# Altium project BMS_Slave.PrjPcb
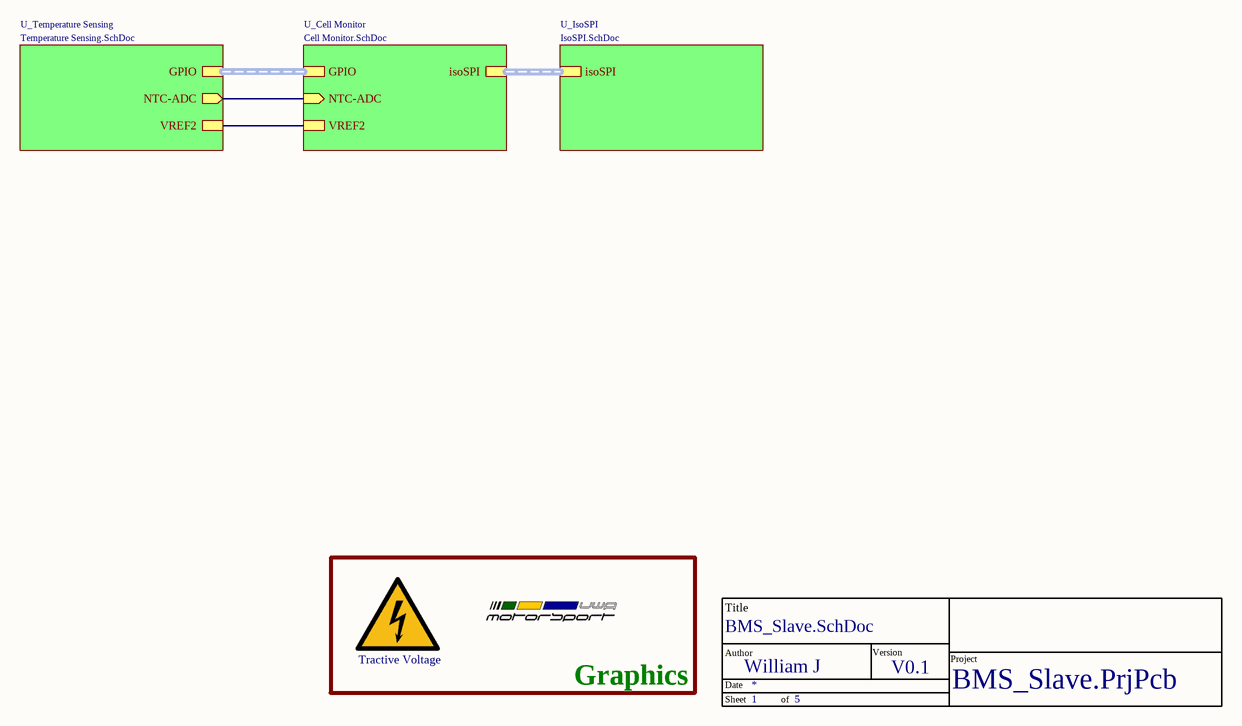
[diagram p0: BMS_Slave.SchDoc]
ProAuthor: William J; Version: V0.1
5 sheets, 168 parts. Net scope: hierarchical (ports join the sheet entries above them; power ports are global).
Sheets:
  BMS_Slave.SchDoc
    U_Cell Monitor = Cell Monitor.SchDoc
      Balance Circuit1 = Balance.SchDoc
      Balance Circuit2 = Balance.SchDoc
      Balance Circuit3 = Balance.SchDoc
      Balance Circuit4 = Balance.SchDoc
      Balance Circuit5 = Balance.SchDoc
      Balance Circuit6 = Balance.SchDoc
      Balance Circuit7 = Balance.SchDoc
      Balance Circuit8 = Balance.SchDoc
      Balance Circuit9 = Balance.SchDoc
      Balance Circuit10 = Balance.SchDoc
      Balance Circuit11 = Balance.SchDoc
      Balance Circuit12 = Balance.SchDoc
    U_IsoSPI = IsoSPI.SchDoc
    U_Temperature Sensing = Temperature Sensing.SchDoc

## Sheet BMS_Slave.SchDoc
size A4; SheetNumber: 1; SheetTotal: 5

### Parts
(Parts that share a designator on the sheet are numbered #1, #2 ... from top to bottom, then left to right.)
*#1  UWAM Logo  [UWAM Logo]  (value not drawn)  (graphical)
*#2  TitleBlock  (value not drawn)  (graphical)
aaa  Tractive voltage symbol  [Tractive voltage]  (value not drawn)  (no BOM)

### Blocks framed on the sheet
Graphics: *#1 aaa

### Sub-sheets
U_Cell Monitor = Cell Monitor.SchDoc: GPIO (harness GPIO), isoSPI (harness isoSPI), VREF2, NTC-ADC (in)
U_IsoSPI = IsoSPI.SchDoc: isoSPI (harness isoSPI)
U_Temperature Sensing = Temperature Sensing.SchDoc: GPIO (harness GPIO), NTC-ADC (out), VREF2

### Nets
VREF2: sheet U_Cell Monitor/VREF2, sheet U_Temperature Sensing/VREF2
NetU1_33: sheet U_Cell Monitor/NTC-ADC, sheet U_Temperature Sensing/NTC-ADC

### Buses and harness runs
harness sheet U_Cell Monitor/GPIO = sheet U_Temperature Sensing/GPIO
harness sheet U_Cell Monitor/isoSPI = sheet U_IsoSPI/isoSPI

### Notes on the sheet
- (in symbol TitleBlock) Title; Author; Version; Project; Date; Sheet; of
- (in symbol Tractive voltage symbol) Tractive Voltage

## Sheet Cell Monitor.SchDoc
size A4; SheetNumber: 2; SheetTotal: 6
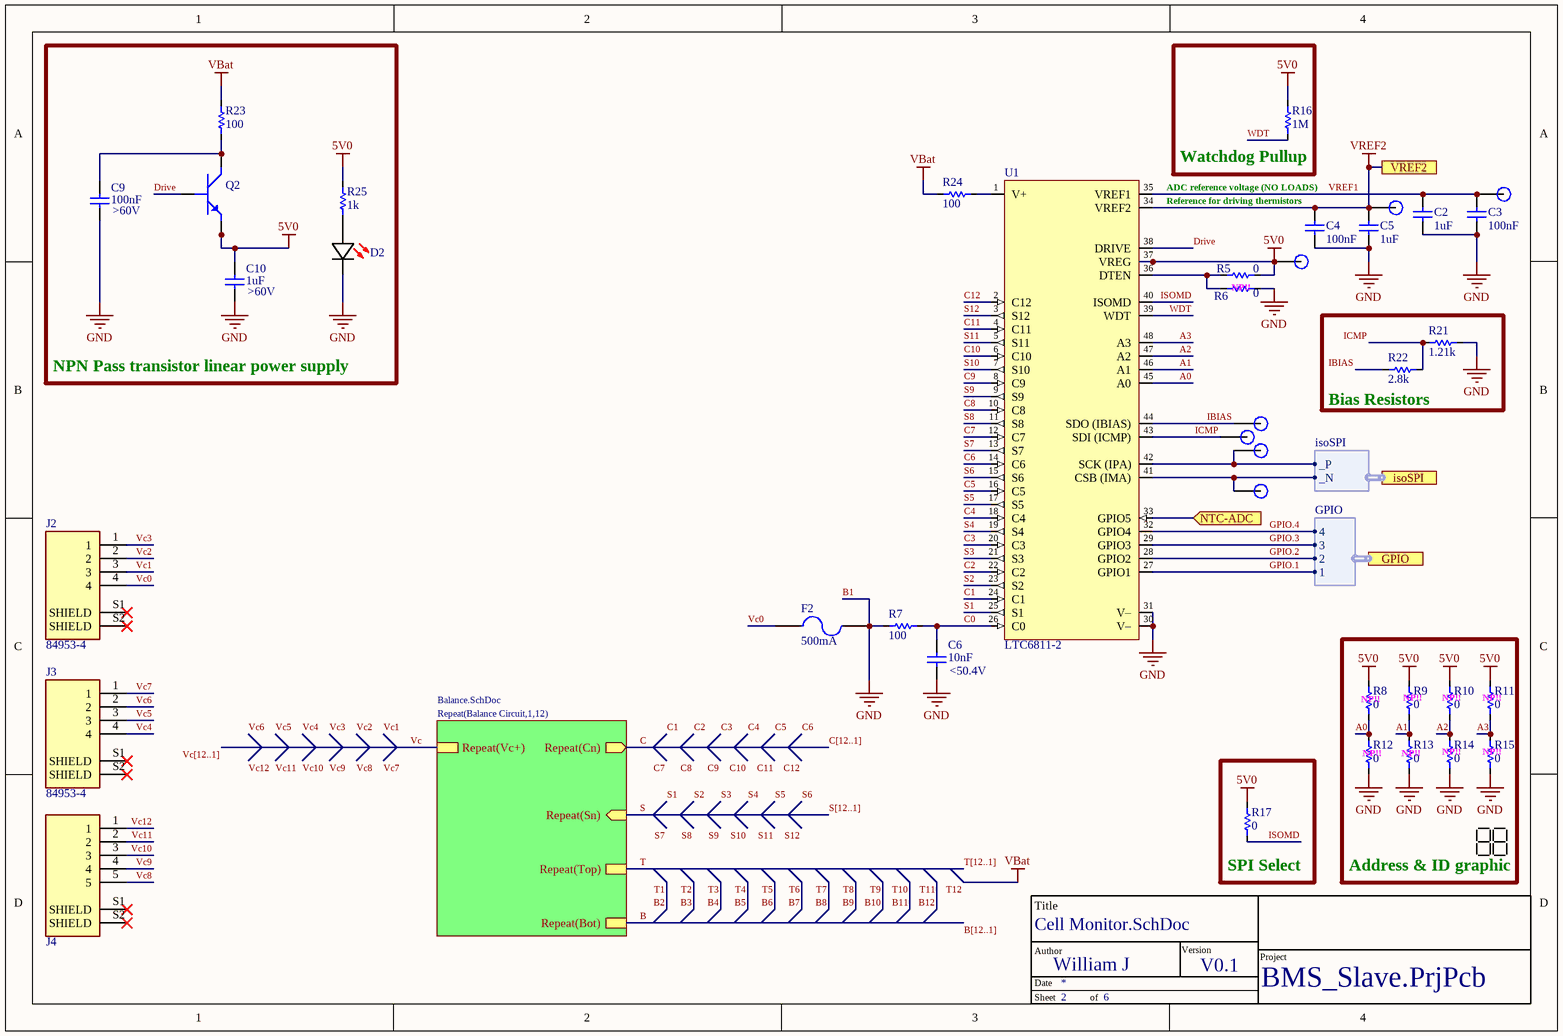
[diagram p1: Cell Monitor.SchDoc]

### Parts
(Parts that share a designator on the sheet are numbered #1, #2 ... from top to bottom, then left to right.)
*#3  TitleBlock  (value not drawn)  (graphical)
C2  value 1uF  [C-0402]  (hidden comment: C)
C3  value 100nF  [C-0402]  (hidden comment: C)
C4  value 100nF  [C-0402]  (hidden comment: C)
C5  value 1uF  [C-0402]  (hidden comment: C)
C6  value 10nF  Voltage: <50.4V  [C_0603]  (hidden comment: C)
C9  value 100nF  Voltage: >60V  [C_0603]  (hidden comment: C)
C10  value 1uF  Voltage: >60V  [C_0603]  (hidden comment: C)
D2  150060SS55040  [LED (0603)]  (value not drawn)
F2  Current Rating: 500mA  [0466.500NR]  (hidden comment: 0466.500NR)
J2  84953-4  [84953-4]
J3  84953-4  [84953-4]
J4  84953-5  [84953-5]  (value not drawn)
NT1  NetTie  [NetTie]  (value not drawn)  (net tie, no BOM)
NT2  NetTie  [NetTie]  (value not drawn)  (net tie, no BOM)
Q2  PHPT60603NYX  [LFPAK56 (SOT669)]  (value not drawn)
R5  value 0  [R_0402]  (hidden comment: Resistor)
R6  value 0  [R_0402]  (hidden comment: Resistor)
R7  value 100  [R-0603]  (hidden comment: Resistor)
R8  value 0  [R_0402]  (hidden comment: Resistor)
R9  value 0  [R_0402]  (hidden comment: Resistor)
R10  value 0  [R_0402]  (hidden comment: Resistor)
R11  value 0  [R_0402]  (hidden comment: Resistor)
R12  value 0  [R_0402]  (hidden comment: Resistor)
R13  value 0  [R_0402]  (hidden comment: Resistor)
R14  value 0  [R_0402]  (hidden comment: Resistor)
R15  value 0  [R_0402]  (hidden comment: Resistor)
R16  value 1M  [R_0402]  (hidden comment: Resistor)
R17  value 0  [R_0402]  (hidden comment: Resistor)
R21  value 1.21k  [R_0402]  (hidden comment: Resistor)
R22  value 2.8k  [R_0402]  (hidden comment: Resistor)
R23  value 100  [R_2010]  (hidden comment: Resistor)
R24  value 100  [R_2010]  (hidden comment: Resistor)
R25  value 1k  [R-0603]  (hidden comment: Resistor)
S1  2x7Segment  [2x7Segment]  (value not drawn)  (no BOM)
TP1  VREF1  [Test Point]  (value not drawn)  (no BOM)
TP2  VREF2  [Test Point]  (value not drawn)  (no BOM)
TP3  5V0  [Test Point]  (value not drawn)  (no BOM)
TP4  IBIAS  [Test Point]  (value not drawn)  (no BOM)
TP5  ICMP  [Test Point]  (value not drawn)  (no BOM)
TP6  IPA  [Test Point]  (value not drawn)  (no BOM)
TP7  IMA  [Test Point]  (value not drawn)  (no BOM)
U1  LTC6811-2  [SSOP50P780X200-48N]

### Blocks framed on the sheet
NPN Pass transistor linear power supply: C9 C10 D2 Q2 R23 R25
Watchdog Pullup: R16
Bias Resistors: R21 R22
Address & ID graphic: R8-R15 S1
SPI Select: R17

### Sub-sheets
Repeat(Balance Circuit,1,12) = Balance.SchDoc: Repeat(Bot), Repeat(Vc+), Repeat(Top), Repeat(Cn) (out), Repeat(Sn) (in)

### Ports
GPIO (harness GPIO), isoSPI (harness isoSPI), NTC-ADC (in), VREF2

### Harnesses
GPIO: 1, 2, 3, 4
isoSPI: _P, _N

### Nets
5V0: C10.2 Q2.1(Emitter) Q2.2(Emitter) Q2.3(Emitter) R5.2 R8.2 R9.2 R10.2 R11.2 R16.2 R17.2 R25.2 TP3.1 U1.37(VREG)
GND: C2.1 C3.1 C4.1 C5.1 C6.1 C9.1 C10.1 D2.1(K) F2.2 NT1.1 R6.1 R7.1 R12.1 R13.1 R14.1 R15.1 R21.2 U1.30(V–) U1.31(V–)
VBat: NT2.2 R23.2 R24.2
VREF2: C4.2 C5.2 TP2.1 U1.34(VREF2) ; port VREF2
A0: R8.1 R12.2 U1.45(A0)
A1: R9.1 R13.2 U1.46(A1)
A2: R10.1 R14.2 U1.47(A2)
A3: R11.1 R15.2 U1.48(A3)
B: sheet Repeat(Balance Circuit,1,12)/Repeat(Bot)
B1: NT1.2
C: sheet Repeat(Balance Circuit,1,12)/Repeat(Cn)
C0: C6.2 R7.2 U1.26(C0)
C1: U1.24(C1)
C2: U1.22(C2)
C3: U1.20(C3)
C4: U1.18(C4)
C5: U1.16(C5)
C6: U1.14(C6)
C7: U1.12(C7)
C8: U1.10(C8)
C9: U1.8(C9)
C10: U1.6(C10)
C11: U1.4(C11)
C12: U1.2(C12)
Drive: Q2.4(Base) U1.38(DRIVE)
GPIO.1: U1.27(GPIO1) ; port GPIO.1
GPIO.2: U1.28(GPIO2) ; port GPIO.2
GPIO.3: U1.29(GPIO3) ; port GPIO.3
GPIO.4: U1.32(GPIO4) ; port GPIO.4
IBIAS: R22.1 TP4.1 U1.44(SDO_(IBIAS))
ICMP: R21.1 R22.2 TP5.1 U1.43(SDI_(ICMP))
ISOMD: R17.1 U1.40(ISOMD)
isoSPI._N: TP7.1 U1.41(CSB_(IMA)) ; port isoSPI._N
isoSPI._P: TP6.1 U1.42(SCK_(IPA)) ; port isoSPI._P
S: sheet Repeat(Balance Circuit,1,12)/Repeat(Sn)
S1: U1.25(S1)
S2: U1.23(S2)
S3: U1.21(S3)
S4: U1.19(S4)
S5: U1.17(S5)
S6: U1.15(S6)
S7: U1.13(S7)
S8: U1.11(S8)
S9: U1.9(S9)
S10: U1.7(S10)
S11: U1.5(S11)
S12: U1.3(S12)
T: sheet Repeat(Balance Circuit,1,12)/Repeat(Top)
T12: NT2.1
Vc: sheet Repeat(Balance Circuit,1,12)/Repeat(Vc+)
Vc0: F2.1 J2.4
Vc1: J2.3
Vc2: J2.2
Vc3: J2.1
Vc4: J3.4
Vc5: J3.3
Vc6: J3.2
Vc7: J3.1
Vc8: J4.5
Vc9: J4.4
Vc10: J4.3
Vc11: J4.2
Vc12: J4.1
VREF1: C2.2 C3.2 TP1.1 U1.35(VREF1)
WDT: R16.1 U1.39(WDT)
NetC9_2: C9.2 Q2.5(Collector) R23.1
NetD2_2: D2.2(A) R25.1
NetR5_1: R5.1 R6.2 U1.36(DTEN)
NetR24_1: R24.1 U1.1(V+)
NetU1_33: U1.33(GPIO5) ; port NTC-ADC

Not connected (* = marked no-connect by the designer): J2 S1(SHIELD)* S2(SHIELD)*; J3 S1(SHIELD)* S2(SHIELD)*; J4 S1(SHIELD)* S2(SHIELD)*

### Buses and harness runs
bus B[12..1]
bus C[12..1]
bus S[12..1]
bus T[12..1]
bus Vc[12..1]

### Notes on the sheet
- ADC reference voltage (NO LOADS)
- (near C4) Reference for driving thermistors
- (near R6) NP!!
- (near R8) NP!!
- (near R9) NP!!
- (near R10) NP!!
- (near R11) NP!!
- (near R12) NP!!
- (near R13) NP!!
- (near R14) NP!!
- (near R15) NP!!
- Labels drawn without touching a wire or pin: C1, C2, C3, C4, C5, C6, C7, C8, C9, C10, C11, C12, S1, S2, S3, S4, S5, S6, S7, S8, S9, S10, S11, S12, Vc1, Vc2, Vc3, Vc4, Vc5, Vc6, Vc7, Vc8, Vc9, Vc10, Vc11, Vc12
- (in symbol TitleBlock) Title; Author; Version; Project; Date; Sheet; of

### Library data of the parts
C2-C6 C9 C10 = Capacitor: ComponentLink1Description: New link; ComponentLink1URL: *
D2 = 150060SS55040: LED RED DIFFUSED 0603 SMD; Manufacturer: Wurth Electronics; Lens Style: Flat; Luminous Intensity: 70mcd; Forward Voltage: 2V; Test Current: 20mA; Viewing Angle: 140°; Dominant Wavelength: 630nm; Lens Size: 0.8mm; Supplier 1: Mouser; Manufacturer Part Number: 150060SS55040; RoHS: No; Category: LEDs; Stock 1: 17006; Pricing 1: 1=0.18000, 10=0.16800, 50=0.16800, 100=0.15200, 1000=0.12100, 10000=0.10600 (USD); Mount: Surface Mount; Case/Package: 0603; Color: Red; Case Code (Imperial): 0603; Case Code (Metric): 1608; Packaging: Tape and Reel; Lens Transparency: Diffused; Length: 1.6mm; Width: 0.8mm; Height: 0.5mm; RoHS Compliant: No; Supplier Part Number 1: 710-150060SS55040
F2 = Fuse 2: LITTELFUSE - 0466.500NR - Fuse, Surface Mount, 500 mA, 466 Series, 63 VAC, 63 VDC, Very Fast Acting, 1206; Body Material: Thermoplastic; Voltage Rating (AC): 63V; Resistance: 350mR; DC Cold Resistance: 248mR; Fuse Type: Board Mount (Cartridge Style Excluded); Approvals: UL,CSA; Published: 8-Jun-2000; LatestRevisionDate: 17-Jul-2002; LatestRevisionNote: Re-released for DXP Platform.; PackageReference: PIN-W2/E2.8; Publisher: Altium Limited; PackageDescription: Thru-Hole; 2 Leads; Supplier 1: Mouser; Supplier Part Number 1: 576-0466.500NR; Manufacturer: Littelfuse; Manufacturer Part Number: 0466.500NR; RoHS: Yes; Category: Fuses; Stock 1: 36497; Pricing 1: 1=0.77000, 10=0.59200, 50=0.59200, 100=0.48900, 1000=0.41600, 10000=0.39000 (USD); Mount: Surface Mount; Case/Package: 1206; Number of Pins: 2; Case Code (Metric): 3216; Case Code (Imperial): 1206; Housing Material: Ceramic; Terminal Material: Copper; Min Operating Temperature: -55°C; Max Operating Temperature: 90°C; Packaging: Tape and Reel; Package Quantity: 5000; Voltage Rating (DC): 63V; Series: 466; Voltage Rating: 63V; Termination: SMD/SMT; Fuse Current: 500mA; Working Voltage: 63V; Length: 3.18mm; Width: 0.06inch; Height: 0.023inch; Depth: 1.52mm; Radiation Hardening: No; RoHS Compliant: Yes; REACH SVHC: Unknown; Lead Free: Lead Free; ComponentLink1URL: https://datasheet.ciiva.com/17081/0466-500nr-17081083.pdf?src-supplier=Allied+Electronics; ComponentLink1Description: https://datasheet.ciiva.com/17081/0466-500nr-17081083.pdf?src-supplier=Allied+Electronics; ComponentLink2URL: https://datasheet.ciiva.com/16327/littelfuse-fuse-466-16327478.pdf?src-supplier=Future+Electronics; ComponentLink2Description: https://datasheet.ciiva.com/16327/littelfuse-fuse-466-16327478.pdf?src-supplier=Future+Electronics; ComponentLink3URL: https://datasheet.ciiva.com/299/466seriesdrawing-299207.pdf?src-supplier=Digi-Key; ComponentLink3Description: https://datasheet.ciiva.com/299/466seriesdrawing-299207.pdf?src-supplier=Digi-Key; ComponentLink4URL: https://datasheet.ciiva.com/299/466seriesdrawing-299208.pdf?src-supplier=Digi-Key; ComponentLink4Description: https://datasheet.ciiva.com/299/466seriesdrawing-299208.pdf?src-supplier=Digi-Key; ComponentLink5URL: https://datasheet.ciiva.com/299/466seriesdrawing-299209.pdf?src-supplier=Digi-Key; ComponentLink5Description: https://datasheet.ciiva.com/299/466seriesdrawing-299209.pdf?src-supplier=Digi-Key; ComponentLink6URL: https://datasheet.ciiva.com/14102/ei466-dat-e-14102891.pdf?src-supplier=Distrelec; ComponentLink6Description: https://datasheet.ciiva.com/14102/ei466-dat-e-14102891.pdf?src-supplier=Distrelec; ComponentLink7URL: https://datasheet.ciiva.com/15186/getdatasheetpartid-57351-15186924.pdf?src-supplier=Verical; ComponentLink7Description: https://datasheet.ciiva.com/15186/getdatasheetpartid-57351-15186924.pdf?src-supplier=Verical
J2 J3 = 84953-4: FPC Connectors, Flex-to-Board, 4 Position, .039 in [1 mm] Centerline, Zero Insertion Force (ZIF), Right Angle, Surface Mount; MF: {'manufacturer': u'TE Connectivity'}; Value: *; Availability: Unavailable; Package: None; MP: 84953-4; Price: None
J4 = 84953-5: FPC Connectors, Flex-to-Board, 5 Position, .039 in [1 mm] Centerline, Zero Insertion Force (ZIF), Right Angle, Surface Mount.
Q2 = PHPT60603NYX: 60V, 3 A NPN high power bipolar transistor
TP1-TP7 = Test Point: 1.2mm Test point
U1 = LTC6811-2: 12 Channel Multicell Battery Monitor with Addressable Interface

## Sheet Balance.SchDoc
size A4; SheetNumber: 3; SheetTotal: 6
Used 12 times, as channels U_Cell Monitor/Balance Circuit1, U_Cell Monitor/Balance Circuit2, U_Cell Monitor/Balance Circuit3, U_Cell Monitor/Balance Circuit4, U_Cell Monitor/Balance Circuit5, U_Cell Monitor/Balance Circuit6, U_Cell Monitor/Balance Circuit7, U_Cell Monitor/Balance Circuit8, U_Cell Monitor/Balance Circuit9, U_Cell Monitor/Balance Circuit10, U_Cell Monitor/Balance Circuit11, U_Cell Monitor/Balance Circuit12. Parts and nets are listed once, with the designators drawn on the sheet.
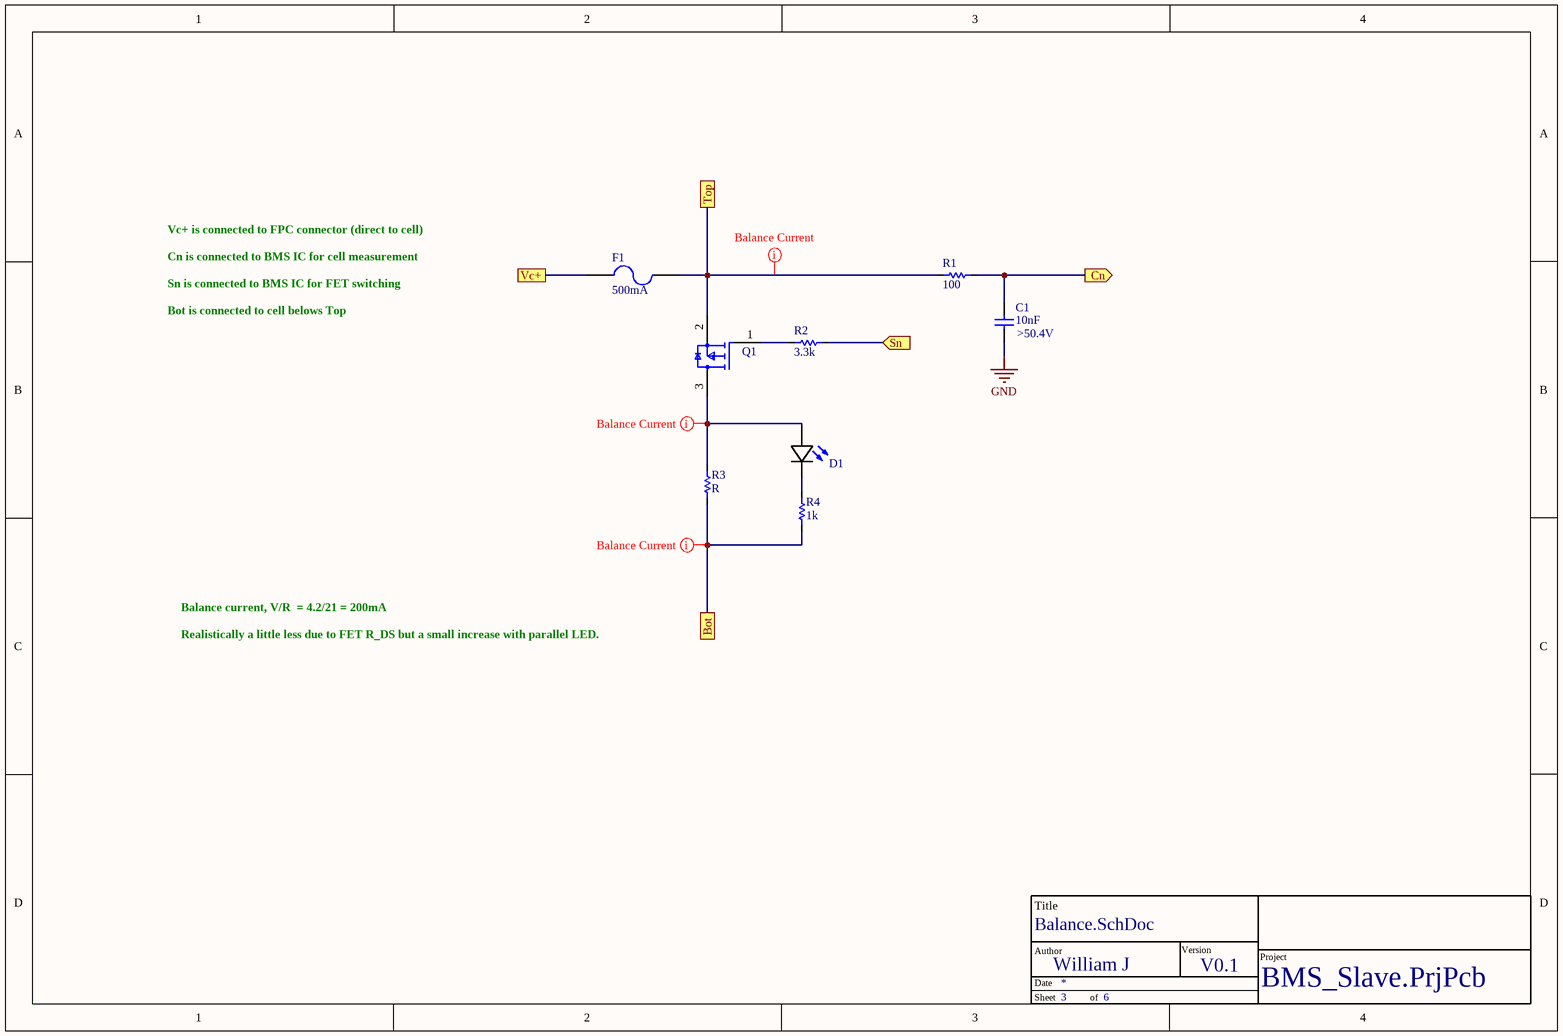
[diagram p2: Balance.SchDoc]

### Parts
*  TitleBlock  (value not drawn)  (graphical)
C1  value 10nF  Voltage: >50.4V  [C_0603]  (hidden comment: C)
D1  150060BS55040  [LED (0603)]  (value not drawn)
F1  Current Rating: 500mA  [0466.500NR]  (hidden comment: 0466.500NR)
Q1  NX2301P,215  [FP-SOT23-MFG]  (value not drawn)
R1  value 100  [R-0603]  (hidden comment: Resistor)
R2  value 3.3k  [R-0603]  (hidden comment: Resistor)
R3  value R  [R_2512]  (hidden comment: Resistor)
R4  value 1k  [R-0603]  (hidden comment: Resistor)

### Ports
Bot, Cn (out), Sn (in), Top, Vc+

### Nets
GND: C1.1
Bot: R3.1 R4.1 ; port Bot
Cn: C1.2 R1.2 ; port Cn
Sn: R2.2 ; port Sn
Top: F1.2 Q1.2(S) R1.1 ; port Top
Vc+: F1.1 ; port Vc+
NetD1_1: D1.1(K) R4.2
NetD1_2: D1.2(A) Q1.3(D) R3.2
NetQ1_1: Q1.1(G) R2.1

### Channels
U_Cell Monitor/Balance Circuit1: designators end in _Balance_Circuit1; ports Bot=B1 Cn=C1 Sn=S1 Top=B2 Vc+=Vc1
U_Cell Monitor/Balance Circuit2: designators end in _Balance_Circuit2; ports Bot=B2 Cn=C2 Sn=S2 Top=B3 Vc+=Vc2
U_Cell Monitor/Balance Circuit3: designators end in _Balance_Circuit3; ports Bot=B3 Cn=C3 Sn=S3 Top=B4 Vc+=Vc3
U_Cell Monitor/Balance Circuit4: designators end in _Balance_Circuit4; ports Bot=B4 Cn=C4 Sn=S4 Top=B5 Vc+=Vc4
U_Cell Monitor/Balance Circuit5: designators end in _Balance_Circuit5; ports Bot=B5 Cn=C5 Sn=S5 Top=B6 Vc+=Vc5
U_Cell Monitor/Balance Circuit6: designators end in _Balance_Circuit6; ports Bot=B6 Cn=C6 Sn=S6 Top=B7 Vc+=Vc6
U_Cell Monitor/Balance Circuit7: designators end in _Balance_Circuit7; ports Bot=B7 Cn=C7 Sn=S7 Top=B8 Vc+=Vc7
U_Cell Monitor/Balance Circuit8: designators end in _Balance_Circuit8; ports Bot=B8 Cn=C8 Sn=S8 Top=B9 Vc+=Vc8
U_Cell Monitor/Balance Circuit9: designators end in _Balance_Circuit9; ports Bot=B9 Cn=C9 Sn=S9 Top=B10 Vc+=Vc9
U_Cell Monitor/Balance Circuit10: designators end in _Balance_Circuit10; ports Bot=B10 Cn=C10 Sn=S10 Top=B11 Vc+=Vc10
U_Cell Monitor/Balance Circuit11: designators end in _Balance_Circuit11; ports Bot=B11 Cn=C11 Sn=S11 Top=B12 Vc+=Vc11
U_Cell Monitor/Balance Circuit12: designators end in _Balance_Circuit12; ports Bot=B12 Cn=C12 Sn=S12 Top=T12 Vc+=Vc12

### Layout directives
net class BalanceNetClass: B1, B2, NetD1_Balance_Circuit1_2

### Notes on the sheet
- Vc+ is connected to FPC connector (direct to cell)
  Cn is connected to BMS IC for cell measurement
  Sn is connected to BMS IC for FET switching
  Bot is connected to cell belows Top
- Balance current, V/R  = 4.2/21 = 200mA
  Realistically a little less due to FET R_DS but a small increase with parallel LED.
- (in symbol TitleBlock) Title; Author; Version; Project; Date; Sheet; of

### Library data of the parts
C1 = Capacitor: ComponentLink1Description: New link; ComponentLink1URL: *
D1 = 150060BS55040: LED BLUE DIFFUSED 0603 SMD; Manufacturer: Wurth Electronics; Lens Style: Flat; Luminous Intensity: 80mcd; Forward Voltage: 3.2V; Test Current: 20mA; Viewing Angle: 140°; Dominant Wavelength: 470nm; Lens Size: 0.8mm; Supplier 1: Mouser; Manufacturer Part Number: 150060BS55040; RoHS: No; Pricing 1: 1=0.18000, 10=0.16800, 50=0.16800, 100=0.15200, 1000=0.12100, 10000=0.10600 (USD); Mount: Surface Mount; Case/Package: 0603; Color: Blue; Packaging: Tape and Reel; Lens Transparency: Diffused; Length: 1.6mm; Width: 0.8mm; Height: 0.5mm; RoHS Compliant: No; ComponentLink1URL: http://www.farnell.com/datasheets/2621640.pdf?src-supplier=Farnell; ComponentLink1Description: http://www.farnell.com/datasheets/2621640.pdf?src-supplier=Farnell; ComponentLink2URL: https://www.we-online.de/web/en/index.php/download/media/07_electronic_components/download_center_1/application_notes_berichte/ano002_leds___the_future_of_horticultural_lighting/ANO002b_EN_LEDs_The_Future_of_Horticultural_Lighting.pdf?src-supplier=Digi-Key; ComponentLink2Description: https://www.we-online.de/web/en/index.php/download/media/07_electronic_components/download_center_1/application_notes_berichte/ano002_leds___the_future_of_horticultural_lighting/ANO002b_EN_LEDs_The_Future_of_Horticultural_Lighting.pdf?src-supplier=Digi-Key; ComponentLink3URL: https://katalog.we-online.de/pbs/datasheet/150060BS55040.pdf?src-supplier=Digi-Key; ComponentLink3Description: https://katalog.we-online.de/pbs/datasheet/150060BS55040.pdf?src-supplier=Digi-Key; ComponentLink4URL: http://www.farnell.com/datasheets/2621640.pdf?src-supplier=Newark; ComponentLink4Description: http://www.farnell.com/datasheets/2621640.pdf?src-supplier=Newark; Supplier Part Number 1: 710-150060BS55040
F1 = Fuse 2: as F2 on sheet Cell Monitor; Published: 8-Jun-2000; LatestRevisionDate: 17-Jul-2002; LatestRevisionNote: Re-released for DXP Platform.; PackageReference: PIN-W2/E2.8; Publisher: Altium Limited; PackageDescription: Thru-Hole; 2 Leads; Supplier 1: Mouser; Supplier Part Number 1: 576-0466.500NR; Manufacturer: Littelfuse; Manufacturer Part Number: 0466.500NR; RoHS: Yes; Category: Fuses; Stock 1: 36497; Pricing 1: 1=0.77000, 10=0.59200, 50=0.59200, 100=0.48900, 1000=0.41600, 10000=0.39000 (USD); Mount: Surface Mount; Case/Package: 1206; Number of Pins: 2; Case Code (Metric): 3216; Case Code (Imperial): 1206; Housing Material: Ceramic; Terminal Material: Copper; Min Operating Temperature: -55°C; Max Operating Temperature: 90°C; Packaging: Tape and Reel; Package Quantity: 5000; Voltage Rating (DC): 63V; Series: 466; Voltage Rating: 63V; Termination: SMD/SMT; Fuse Current: 500mA; Working Voltage: 63V; Length: 3.18mm; Width: 0.06inch; Height: 0.023inch; Depth: 1.52mm; Radiation Hardening: No; RoHS Compliant: Yes; REACH SVHC: Unknown; Lead Free: Lead Free; ComponentLink1URL: https://datasheet.ciiva.com/17081/0466-500nr-17081083.pdf?src-supplier=Allied+Electronics; ComponentLink1Description: https://datasheet.ciiva.com/17081/0466-500nr-17081083.pdf?src-supplier=Allied+Electronics; ComponentLink2URL: https://datasheet.ciiva.com/16327/littelfuse-fuse-466-16327478.pdf?src-supplier=Future+Electronics; ComponentLink2Description: https://datasheet.ciiva.com/16327/littelfuse-fuse-466-16327478.pdf?src-supplier=Future+Electronics; ComponentLink3URL: https://datasheet.ciiva.com/299/466seriesdrawing-299207.pdf?src-supplier=Digi-Key; ComponentLink3Description: https://datasheet.ciiva.com/299/466seriesdrawing-299207.pdf?src-supplier=Digi-Key; ComponentLink4URL: https://datasheet.ciiva.com/299/466seriesdrawing-299208.pdf?src-supplier=Digi-Key; ComponentLink4Description: https://datasheet.ciiva.com/299/466seriesdrawing-299208.pdf?src-supplier=Digi-Key; ComponentLink5URL: https://datasheet.ciiva.com/299/466seriesdrawing-299209.pdf?src-supplier=Digi-Key; ComponentLink5Description: https://datasheet.ciiva.com/299/466seriesdrawing-299209.pdf?src-supplier=Digi-Key; ComponentLink6URL: https://datasheet.ciiva.com/14102/ei466-dat-e-14102891.pdf?src-supplier=Distrelec; ComponentLink6Description: https://datasheet.ciiva.com/14102/ei466-dat-e-14102891.pdf?src-supplier=Distrelec; ComponentLink7URL: https://datasheet.ciiva.com/15186/getdatasheetpartid-57351-15186924.pdf?src-supplier=Verical; ComponentLink7Description: https://datasheet.ciiva.com/15186/getdatasheetpartid-57351-15186924.pdf?src-supplier=Verical
Q1 = CMP-14409-000018-1: MOSFET P-CH 20V 2A TO-236AB

## Sheet IsoSPI.SchDoc
size A4; SheetNumber: 4; SheetTotal: 6
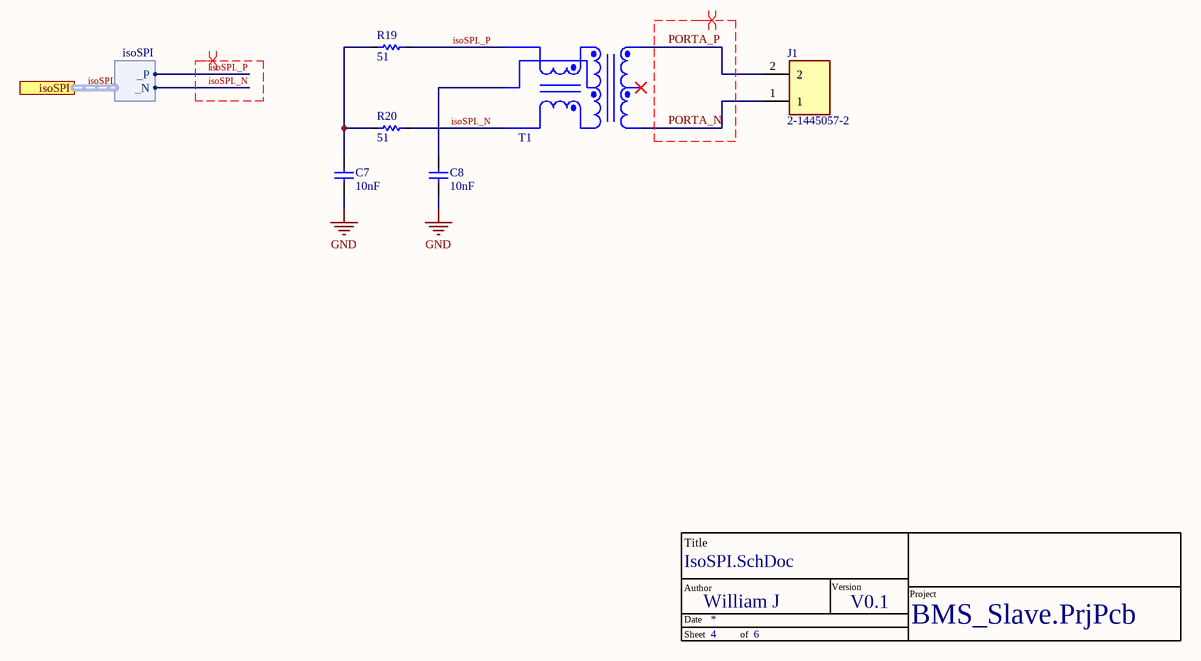
[diagram p3: IsoSPI.SchDoc]

### Parts
(Parts that share a designator on the sheet are numbered #1, #2 ... from top to bottom, then left to right.)
*#4  TitleBlock  (value not drawn)  (graphical)
C7  value 10nF  [C-0402]  (hidden comment: C)
C8  value 10nF  [C-0402]  (hidden comment: C)
J1  2-1445057-2  [TE_2-1445057-2]
R19  value 51  [R_0402]  (hidden comment: Resistor)
R20  value 51  [R_0402]  (hidden comment: Resistor)
T1  SM91502ALE  [SM91502ALE]  (value not drawn)

### Ports
isoSPI (harness isoSPI)

### Harnesses
isoSPI: _P, _N

### Nets
GND: C7.1 C8.1
isoSPI._N: R20.2 T1.4 ; port isoSPI._N
isoSPI._P: R19.2 T1.6 ; port isoSPI._P
PORTA_N: J1.1 T1.3
PORTA_P: J1.2 T1.1
NetC7_2: C7.2 R19.1 R20.1
NetC8_2: C8.2 T1.5

Not connected (* = marked no-connect by the designer): T1 2*

### Buses and harness runs
harness isoSPI = port isoSPI

### Layout directives
differential pair; differential pair class isoSPI: isoSPI._N, isoSPI._P, PORTA_N, PORTA_P

### Notes on the sheet
- (in symbol TitleBlock) Title; Author; Version; Project; Date; Sheet; of

### Library data of the parts
C7 C8 = Capacitor: ComponentLink1Description: New link; ComponentLink1URL: *
J1 = 2-1445057-2: CONN HEADER 3MM 2POS R/A TIN SMD; MF: {'manufacturer': u'TE Connectivity'}; Package: None; MP: 2-1445057-2; Availability: Unavailable; Price: None; Value: *
T1 = SM91502ALE: BMS XFORMER 1-CH 1000V AECQ +125; Manufacturer: Bourns; Inductance: 150uH; Turns Ratio: 1:1; Supplier 1: RSComponents; Manufacturer Part Number: SM91502ALE; RoHS: Yes; Category: Transformers; Stock 1: 1; Pricing 1: 800=2.35100 (USD); Mount: Surface Mount; Min Operating Temperature: -40°C; Max Operating Temperature: 125°C; Packaging: Cut Tape; ComponentLink1URL: https://www.bourns.com/docs/Product-Datasheets/SM91502AL.pdf?src-supplier=Digi-Key; ComponentLink1Description: https://www.bourns.com/docs/Product-Datasheets/SM91502AL.pdf?src-supplier=Digi-Key; Supplier Part Number 1: 1802382

## Sheet Temperature Sensing.SchDoc
size A4; SheetNumber: 5; SheetTotal: 6
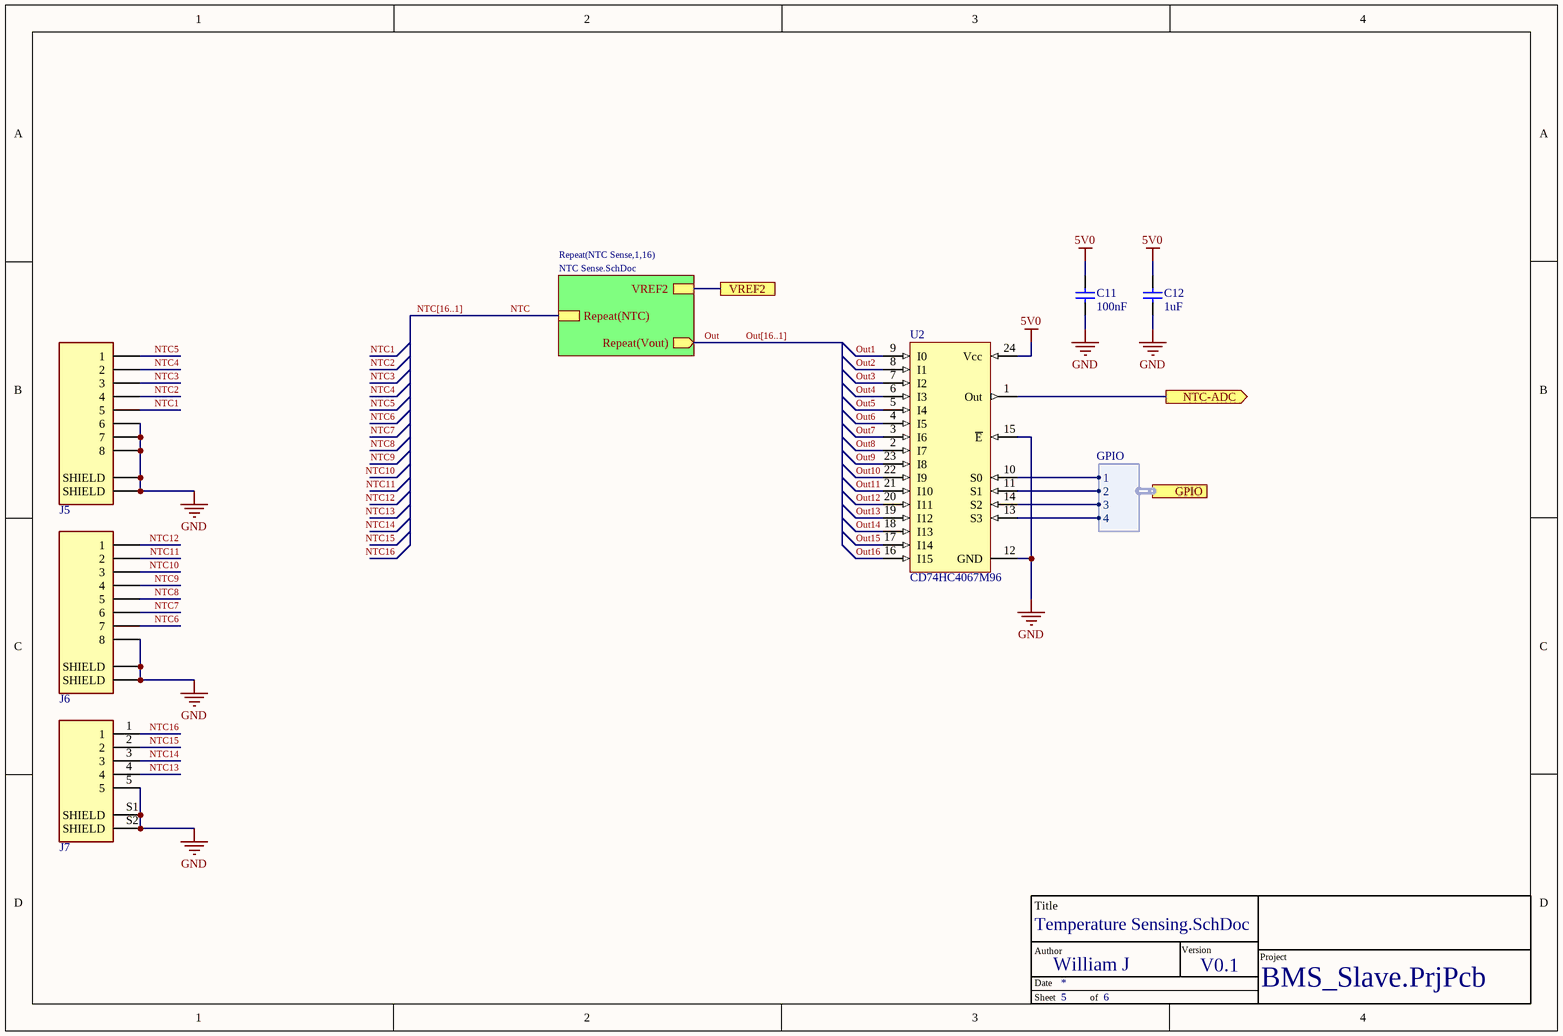
[diagram p4: Temperature Sensing.SchDoc]

### Parts
*?  TitleBlock  (value not drawn)  (graphical)
C11  value 100nF  [C_0603]  (hidden comment: C)
C12  value 1uF  [C_0603]  (hidden comment: C)
J5  84953-8  [84953-8]  (value not drawn)
J6  84953-8  [84953-8]  (value not drawn)
J7  84953-5  [84953-5]  (value not drawn)
U2  CD74HC4067M96  [SOIC127P1030X265-24N]

### Sub-sheets
Repeat(NTC Sense,1,16) = NTC Sense.SchDoc (file not in this document): VREF2, Repeat(Vout) (out), Repeat(NTC)

### Ports
GPIO (harness GPIO), NTC-ADC (out), VREF2

### Harnesses
GPIO: 4, 3, 2, 1

### Nets
5V0: C11.1 C12.2 U2.24(Vcc)
GND: C11.2 C12.1 J5.6 J5.7 J5.8 J5.S1(SHIELD) J5.S2(SHIELD) J6.8 J6.S1(SHIELD) J6.S2(SHIELD) J7.5 J7.S1(SHIELD) J7.S2(SHIELD) U2.12(GND) U2.15(~{E})
VREF2: port VREF2, sheet Repeat(NTC Sense,1,16)/VREF2
GPIO.1: U2.10(S0) ; port GPIO.1
GPIO.2: U2.11(S1) ; port GPIO.2
GPIO.3: U2.14(S2) ; port GPIO.3
GPIO.4: U2.13(S3) ; port GPIO.4
NTC: sheet Repeat(NTC Sense,1,16)/Repeat(NTC)
NTC1: J5.5
NTC2: J5.4
NTC3: J5.3
NTC4: J5.2
NTC5: J5.1
NTC6: J6.7
NTC7: J6.6
NTC8: J6.5
NTC9: J6.4
NTC10: J6.3
NTC11: J6.2
NTC12: J6.1
NTC13: J7.4
NTC14: J7.3
NTC15: J7.2
NTC16: J7.1
Out: sheet Repeat(NTC Sense,1,16)/Repeat(Vout)
Out1: U2.9(I0)
Out2: U2.8(I1)
Out3: U2.7(I2)
Out4: U2.6(I3)
Out5: U2.5(I4)
Out6: U2.4(I5)
Out7: U2.3(I6)
Out8: U2.2(I7)
Out9: U2.23(I8)
Out10: U2.22(I9)
Out11: U2.21(I10)
Out12: U2.20(I11)
Out13: U2.19(I12)
Out14: U2.18(I13)
Out15: U2.17(I14)
Out16: U2.16(I15)
NetU1_33: U2.1(Out) ; port NTC-ADC

### Buses and harness runs
bus NTC[16..1]
bus Out[16..1]

### Notes on the sheet
- (in symbol TitleBlock) Title; Author; Version; Project; Date; Sheet; of

### Library data of the parts
C11 C12 = Capacitor: ComponentLink1Description: New link; ComponentLink1URL: *
J5 J6 = 84953-8: FPC Connectors, Flex-to-Board, 8 Position, .039 in [1 mm] Centerline, Zero Insertion Force (ZIF), Right Angle, Surface Mount; Manufacturer: TE Connectivity; Body Plating: Tin; Voltage Rating: 200V; Number of Contacts: 8; Current Rating: 1A; Gender: Female; Connector Type: Receptacle,Connector,Socket; Shielding: Unshielded; Wire/Cable Type: Flat Flex; Mating Alignment: Yes (With); PCB Mount Alignment: No (Without); PCB Mount Retention: With; Contact Location: Top; Pitch: 0.039inch; Plating Thickness: 2um; Supplier 1: RSComponents; Manufacturer Part Number: 84953-8; RoHS: Yes; Category: FFC / FPC; Stock 1: 1; Pricing 1: 10=0.83500, 200=0.65000, 750=0.58600, 3000=0.55400, 6000=0.54000 (USD); Mount: Surface Mount; Contact Material: Bronze; Contact Plating: Tin,Bright; Housing Material: Polymer; Housing Color: Natural; Color: Natural; Material: Thermoplastic; Min Operating Temperature: -40°C; Max Operating Temperature: 85°C; Termination: SMD/SMT; Package Quantity: 1500; Packaging: Tape and Reel; Number of Rows: 1; Orientation: Right Angle; Contact Current Rating: 1A; Connector System: Flex-to-Board; Number of Positions: 8; PCB Mounting Orientation: Right Angle; Sealable: No (Without); Shrouded: Yes (With); Length: 0.6268inch; Width: 0.2575inch; Height: 2.56mm; Depth: 2.56mm; Lead Pitch: 1mm; Radiation Hardening: No; REACH SVHC: No SVHC; Flammability Rating: UL94 V-0; ComponentLink1URL: https://datasheet.ciiva.com/11745/0900766b806b36e9-11745458.pdf?src-supplier=RSComponents; ComponentLink1Description: https://datasheet.ciiva.com/11745/0900766b806b36e9-11745458.pdf?src-supplier=RSComponents; ComponentLink2URL: https://datasheet.ciiva.com/669/eng-cd-84953-a3-669123.pdf?src-supplier=Digi-Key; ComponentLink2Description: https://datasheet.ciiva.com/669/eng-cd-84953-a3-669123.pdf?src-supplier=Digi-Key; ComponentLink3URL: https://datasheet.ciiva.com/669/eng-cd-84953-a3-669124.pdf?src-supplier=Digi-Key; ComponentLink3Description: https://datasheet.ciiva.com/669/eng-cd-84953-a3-669124.pdf?src-supplier=Digi-Key; ComponentLink4URL: https://datasheet.ciiva.com/14483/eng-ds-1-1773440-6-0506-14483319.pdf?src-supplier=Farnell; ComponentLink4Description: https://datasheet.ciiva.com/14483/eng-ds-1-1773440-6-0506-14483319.pdf?src-supplier=Farnell; ComponentLink5URL: https://datasheet.ciiva.com/26825/getdatasheetpartid-473787-26825575.pdf?src-supplier=Verical; ComponentLink5Description: https://datasheet.ciiva.com/26825/getdatasheetpartid-473787-26825575.pdf?src-supplier=Verical; ComponentLink6URL: https://datasheet.ciiva.com/8066/586796-8066664.pdf?src-supplier=Element14; ComponentLink6Description: https://datasheet.ciiva.com/8066/586796-8066664.pdf?src-supplier=Element14; ComponentLink7URL: https://datasheet.ciiva.com/669/eng-cd-84953-a3-669122.pdf?src-supplier=Digi-Key; ComponentLink7Description: https://datasheet.ciiva.com/669/eng-cd-84953-a3-669122.pdf?src-supplier=Digi-Key; ComponentLink8URL: https://datasheet.ciiva.com/16658/eng-ds-1-1773440-6-0506-16658613.pdf?src-supplier=Avnet+Europe; ComponentLink8Description: https://datasheet.ciiva.com/16658/eng-ds-1-1773440-6-0506-16658613.pdf?src-supplier=Avnet+Europe; ComponentLink9URL: https://datasheet.ciiva.com/8066/586796-8066666.pdf?src-supplier=Element14; ComponentLink9Description: https://datasheet.ciiva.com/8066/586796-8066666.pdf?src-supplier=Element14; ComponentLink10URL: https://datasheet.ciiva.com/30100/eng-ds-1-1773440-6-0506-30100492.pdf?src-supplier=Onlinecomponents.com; ComponentLink10Description: https://datasheet.ciiva.com/30100/eng-ds-1-1773440-6-0506-30100492.pdf?src-supplier=Onlinecomponents.com; ComponentLink11URL: https://datasheet.ciiva.com/10034/eng-ds-1-1773440-6-0506-10034351.pdf?src-supplier=Avnet; ComponentLink11Description: https://datasheet.ciiva.com/10034/eng-ds-1-1773440-6-0506-10034351.pdf?src-supplier=Avnet; Supplier Part Number 1: 5351707P
J7 = 84953-5: as J4 on sheet Cell Monitor
U2 = CD74HC4067M96: High-Speed CMOS Logic / 16-Channel Analog Multiplexer/Demultiplexer

## Nets that join several sheets
5V0: Cell Monitor (14 pins), Temperature Sensing (C11.1 C12.2 U2.24)
GND: Cell Monitor (19 pins), U_Cell Monitor/Balance Circuit1 (C1_Balance_Circuit1.1), U_Cell Monitor/Balance Circuit2 (C1_Balance_Circuit2.1), U_Cell Monitor/Balance Circuit3 (C1_Balance_Circuit3.1), U_Cell Monitor/Balance Circuit4 (C1_Balance_Circuit4.1), U_Cell Monitor/Balance Circuit5 (C1_Balance_Circuit5.1), U_Cell Monitor/Balance Circuit6 (C1_Balance_Circuit6.1), U_Cell Monitor/Balance Circuit7 (C1_Balance_Circuit7.1), U_Cell Monitor/Balance Circuit8 (C1_Balance_Circuit8.1), U_Cell Monitor/Balance Circuit9 (C1_Balance_Circuit9.1), U_Cell Monitor/Balance Circuit10 (C1_Balance_Circuit10.1), U_Cell Monitor/Balance Circuit11 (C1_Balance_Circuit11.1), U_Cell Monitor/Balance Circuit12 (C1_Balance_Circuit12.1), IsoSPI (C7.1 C8.1), Temperature Sensing (15 pins)
B1: Cell Monitor (NT1.2), U_Cell Monitor/Balance Circuit1 (R3_Balance_Circuit1.1 R4_Balance_Circuit1.1)
B2: U_Cell Monitor/Balance Circuit1 (F1_Balance_Circuit1.2 Q1_Balance_Circuit1.2 R1_Balance_Circuit1.1), U_Cell Monitor/Balance Circuit2 (R3_Balance_Circuit2.1 R4_Balance_Circuit2.1)
B3: U_Cell Monitor/Balance Circuit2 (F1_Balance_Circuit2.2 Q1_Balance_Circuit2.2 R1_Balance_Circuit2.1), U_Cell Monitor/Balance Circuit3 (R3_Balance_Circuit3.1 R4_Balance_Circuit3.1)
B4: U_Cell Monitor/Balance Circuit3 (F1_Balance_Circuit3.2 Q1_Balance_Circuit3.2 R1_Balance_Circuit3.1), U_Cell Monitor/Balance Circuit4 (R3_Balance_Circuit4.1 R4_Balance_Circuit4.1)
B5: U_Cell Monitor/Balance Circuit4 (F1_Balance_Circuit4.2 Q1_Balance_Circuit4.2 R1_Balance_Circuit4.1), U_Cell Monitor/Balance Circuit5 (R3_Balance_Circuit5.1 R4_Balance_Circuit5.1)
B6: U_Cell Monitor/Balance Circuit5 (F1_Balance_Circuit5.2 Q1_Balance_Circuit5.2 R1_Balance_Circuit5.1), U_Cell Monitor/Balance Circuit6 (R3_Balance_Circuit6.1 R4_Balance_Circuit6.1)
B7: U_Cell Monitor/Balance Circuit6 (F1_Balance_Circuit6.2 Q1_Balance_Circuit6.2 R1_Balance_Circuit6.1), U_Cell Monitor/Balance Circuit7 (R3_Balance_Circuit7.1 R4_Balance_Circuit7.1)
B8: U_Cell Monitor/Balance Circuit7 (F1_Balance_Circuit7.2 Q1_Balance_Circuit7.2 R1_Balance_Circuit7.1), U_Cell Monitor/Balance Circuit8 (R3_Balance_Circuit8.1 R4_Balance_Circuit8.1)
B9: U_Cell Monitor/Balance Circuit8 (F1_Balance_Circuit8.2 Q1_Balance_Circuit8.2 R1_Balance_Circuit8.1), U_Cell Monitor/Balance Circuit9 (R3_Balance_Circuit9.1 R4_Balance_Circuit9.1)
B10: U_Cell Monitor/Balance Circuit9 (F1_Balance_Circuit9.2 Q1_Balance_Circuit9.2 R1_Balance_Circuit9.1), U_Cell Monitor/Balance Circuit10 (R3_Balance_Circuit10.1 R4_Balance_Circuit10.1)
B11: U_Cell Monitor/Balance Circuit10 (F1_Balance_Circuit10.2 Q1_Balance_Circuit10.2 R1_Balance_Circuit10.1), U_Cell Monitor/Balance Circuit11 (R3_Balance_Circuit11.1 R4_Balance_Circuit11.1)
B12: U_Cell Monitor/Balance Circuit11 (F1_Balance_Circuit11.2 Q1_Balance_Circuit11.2 R1_Balance_Circuit11.1), U_Cell Monitor/Balance Circuit12 (R3_Balance_Circuit12.1 R4_Balance_Circuit12.1)
C1: Cell Monitor (U1.24), U_Cell Monitor/Balance Circuit1 (C1_Balance_Circuit1.2 R1_Balance_Circuit1.2)
C2: Cell Monitor (U1.22), U_Cell Monitor/Balance Circuit2 (C1_Balance_Circuit2.2 R1_Balance_Circuit2.2)
C3: Cell Monitor (U1.20), U_Cell Monitor/Balance Circuit3 (C1_Balance_Circuit3.2 R1_Balance_Circuit3.2)
C4: Cell Monitor (U1.18), U_Cell Monitor/Balance Circuit4 (C1_Balance_Circuit4.2 R1_Balance_Circuit4.2)
C5: Cell Monitor (U1.16), U_Cell Monitor/Balance Circuit5 (C1_Balance_Circuit5.2 R1_Balance_Circuit5.2)
C6: Cell Monitor (U1.14), U_Cell Monitor/Balance Circuit6 (C1_Balance_Circuit6.2 R1_Balance_Circuit6.2)
C7: Cell Monitor (U1.12), U_Cell Monitor/Balance Circuit7 (C1_Balance_Circuit7.2 R1_Balance_Circuit7.2)
C8: Cell Monitor (U1.10), U_Cell Monitor/Balance Circuit8 (C1_Balance_Circuit8.2 R1_Balance_Circuit8.2)
C9: Cell Monitor (U1.8), U_Cell Monitor/Balance Circuit9 (C1_Balance_Circuit9.2 R1_Balance_Circuit9.2)
C10: Cell Monitor (U1.6), U_Cell Monitor/Balance Circuit10 (C1_Balance_Circuit10.2 R1_Balance_Circuit10.2)
C11: Cell Monitor (U1.4), U_Cell Monitor/Balance Circuit11 (C1_Balance_Circuit11.2 R1_Balance_Circuit11.2)
C12: Cell Monitor (U1.2), U_Cell Monitor/Balance Circuit12 (C1_Balance_Circuit12.2 R1_Balance_Circuit12.2)
GPIO.1: Cell Monitor (U1.27), Temperature Sensing (U2.10)
GPIO.2: Cell Monitor (U1.28), Temperature Sensing (U2.11)
GPIO.3: Cell Monitor (U1.29), Temperature Sensing (U2.14)
GPIO.4: Cell Monitor (U1.32), Temperature Sensing (U2.13)
isoSPI._N: Cell Monitor (TP7.1 U1.41), IsoSPI (R20.2 T1.4)
isoSPI._P: Cell Monitor (TP6.1 U1.42), IsoSPI (R19.2 T1.6)
NetU1_33: Cell Monitor (U1.33), Temperature Sensing (U2.1)
S1: Cell Monitor (U1.25), U_Cell Monitor/Balance Circuit1 (R2_Balance_Circuit1.2)
S2: Cell Monitor (U1.23), U_Cell Monitor/Balance Circuit2 (R2_Balance_Circuit2.2)
S3: Cell Monitor (U1.21), U_Cell Monitor/Balance Circuit3 (R2_Balance_Circuit3.2)
S4: Cell Monitor (U1.19), U_Cell Monitor/Balance Circuit4 (R2_Balance_Circuit4.2)
S5: Cell Monitor (U1.17), U_Cell Monitor/Balance Circuit5 (R2_Balance_Circuit5.2)
S6: Cell Monitor (U1.15), U_Cell Monitor/Balance Circuit6 (R2_Balance_Circuit6.2)
S7: Cell Monitor (U1.13), U_Cell Monitor/Balance Circuit7 (R2_Balance_Circuit7.2)
S8: Cell Monitor (U1.11), U_Cell Monitor/Balance Circuit8 (R2_Balance_Circuit8.2)
S9: Cell Monitor (U1.9), U_Cell Monitor/Balance Circuit9 (R2_Balance_Circuit9.2)
S10: Cell Monitor (U1.7), U_Cell Monitor/Balance Circuit10 (R2_Balance_Circuit10.2)
S11: Cell Monitor (U1.5), U_Cell Monitor/Balance Circuit11 (R2_Balance_Circuit11.2)
S12: Cell Monitor (U1.3), U_Cell Monitor/Balance Circuit12 (R2_Balance_Circuit12.2)
T12: Cell Monitor (NT2.1), U_Cell Monitor/Balance Circuit12 (F1_Balance_Circuit12.2 Q1_Balance_Circuit12.2 R1_Balance_Circuit12.1)
Vc1: Cell Monitor (J2.3), U_Cell Monitor/Balance Circuit1 (F1_Balance_Circuit1.1)
Vc2: Cell Monitor (J2.2), U_Cell Monitor/Balance Circuit2 (F1_Balance_Circuit2.1)
Vc3: Cell Monitor (J2.1), U_Cell Monitor/Balance Circuit3 (F1_Balance_Circuit3.1)
Vc4: Cell Monitor (J3.4), U_Cell Monitor/Balance Circuit4 (F1_Balance_Circuit4.1)
Vc5: Cell Monitor (J3.3), U_Cell Monitor/Balance Circuit5 (F1_Balance_Circuit5.1)
Vc6: Cell Monitor (J3.2), U_Cell Monitor/Balance Circuit6 (F1_Balance_Circuit6.1)
Vc7: Cell Monitor (J3.1), U_Cell Monitor/Balance Circuit7 (F1_Balance_Circuit7.1)
Vc8: Cell Monitor (J4.5), U_Cell Monitor/Balance Circuit8 (F1_Balance_Circuit8.1)
Vc9: Cell Monitor (J4.4), U_Cell Monitor/Balance Circuit9 (F1_Balance_Circuit9.1)
Vc10: Cell Monitor (J4.3), U_Cell Monitor/Balance Circuit10 (F1_Balance_Circuit10.1)
Vc11: Cell Monitor (J4.2), U_Cell Monitor/Balance Circuit11 (F1_Balance_Circuit11.1)
Vc12: Cell Monitor (J4.1), U_Cell Monitor/Balance Circuit12 (F1_Balance_Circuit12.1)